# Altium schematic sheet smartBattery.SchDoc
size A4; SheetNumber: 1; SheetTotal: 1
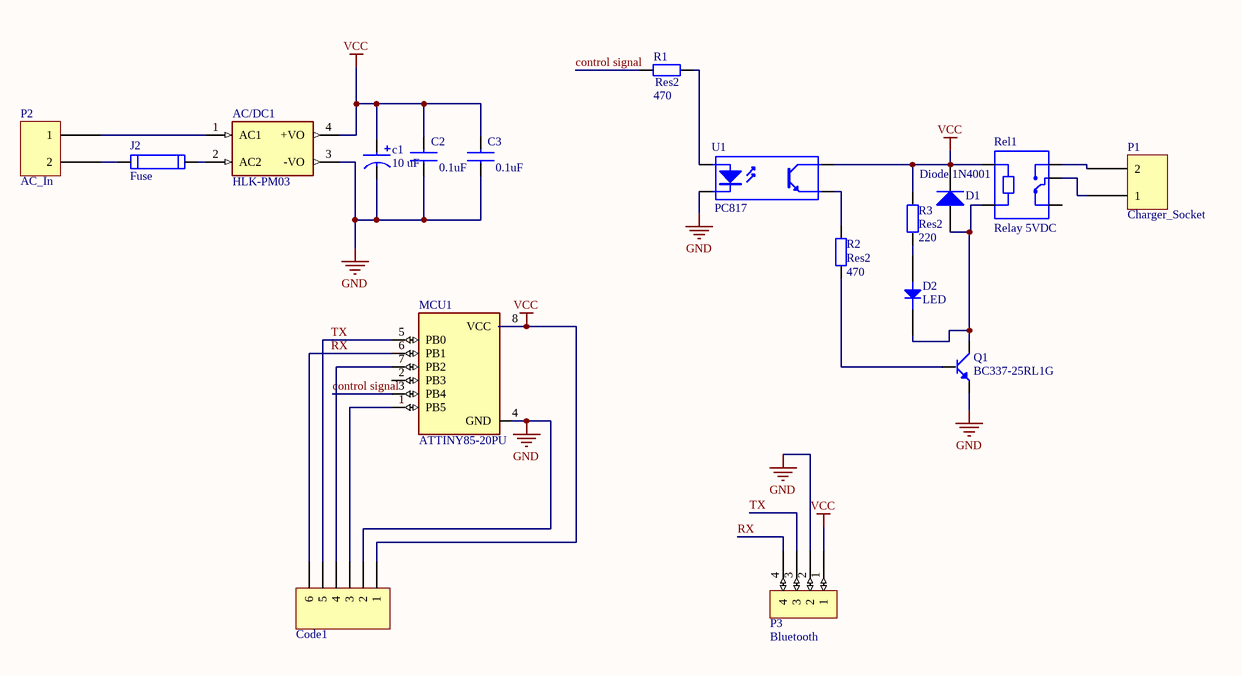
[diagram p0: smartBattery.SchDoc]

## Parts
AC/DC1  HLK-PM03  [CONV_HLK-PM03]
c1  10 uF  [AluminumCap]
C2  0.1uF  [ceramicCapTHT]
C3  0.1uF  [ceramicCapTHT]
Code1  (no value)  [HDR1X6]
D1  Diode 1N4001  [DO-41]
D2  LED  [SDO27]
J2  Fuse  [696310001002]
MCU1  ATTINY85-20PU  [DIP762W46P254L927H533Q8B]
P1  Charger_Socket  [TB_2Pin]
P2  AC_In  [TB_2Pin]
P3  Bluetooth  [pinhead_01x04]
Q1  BC337-25RL1G  [TO-92]
R1  Res2  value 470  [AXIAL-0.4]
R2  Res2  value 470  [AXIAL-0.4]
R3  Res2  value 220  [AXIAL-0.4]
Rel1  Relay 5VDC  [RELAY_SRD-05VDC-SL-C]
U1  PC817  [DIP-4]

## Nets
GND: AC/DC1.3(-VO) c1.2 C2.1 C3.1 Code1.2 MCU1.4(GND) P3.2 Q1.3(E) U1.2(K)
VCC: AC/DC1.4(+VO) c1.1 C2.2 C3.2 Code1.1 D1.2(K) MCU1.8(VCC) P3.1 R3.2 Rel1.A1 U1.4(C)
control signal: MCU1.3(PB4) R1.1
RX: Code1.6 MCU1.6(PB1) P3.4
TX: Code1.5 MCU1.5(PB0) P3.3
NetAC/DC1_1: AC/DC1.1(AC1) P2.1
NetAC/DC1_2: AC/DC1.2(AC2) J2.2
NetCode1_3: Code1.3 MCU1.1(PB5)
NetCode1_4: Code1.4 MCU1.7(PB2)
NetD1_1: D1.1(A) D2.2 Q1.1(C) Rel1.A2
NetD2_1: D2.1 R3.1
NetJ2_1: J2.1 P2.2
NetP1_1: P1.1 Rel1.COM
NetP1_2: P1.2 Rel1.NO
NetQ1_2: Q1.2(B) R2.1
NetR1_2: R1.2 U1.1(A)
NetR2_2: R2.2 U1.3(E)

Not connected (* = marked no-connect by the designer): MCU1 2(PB3); Rel1 NC

## Library data of the parts
AC/DC1 = HLK-PM03: AC DC 3W power module; MF: Hi-link; Package: Package; Availability: Unavailable; SnapEDA_Link: https://www.snapeda.com/parts/HLK-PM03/Hi-link/view-part/3215695/?ref=snap; MP: HLK-PM03; Price: None; Value: *
c1 = AluminumCap: Cap Aluminum 10uF 400V 20% (10 X 16mm) Radial 5mm 150mA 8000 hr 105C Bulk; Manufacturer 1: Nichicon; Manufacturer Part Number 1: UCY2G100MPD; Supplier 1: Digi-Key; Description 1: Cap Aluminum 10uF 400V 20% (10 X 16mm) Radial 5mm 150mA 8000 hr 105C Bulk; Stock 1: 39516; Pricing 1: 1=0.82, 10=0.622, 50=0.5164, 100=0.4447, 500=0.3443, 1000=0.2965, 2500=0.2773, 5000=0.263 (USD); Capacitance: 10 uF; Case Size/Dimension: 10 x 16 mm; Type: Radial; Rated Voltage: 400 V; Operating Temp-Max: 105 C; ComponentLink1URL: http://www.nichicon.co.jp/english/products/pdfs/e-cy.pdf?src-supplier=Avnet; ComponentLink1Description: http://www.nichicon.co.jp/english/products/pdfs/e-cy.pdf?src-supplier=Avnet; ComponentLink2URL: https://www.verical.com/server-webapp/html/getDatasheet?partID=464569&src-supplier=Verical; ComponentLink2Description: https://www.verical.com/server-webapp/html/getDatasheet?partID=464569&src-supplier=Verical; ComponentLink3URL: http://www.farnell.com/datasheets/51405.pdf?src-supplier=Element14; ComponentLink3Description: http://www.farnell.com/datasheets/51405.pdf?src-supplier=Element14; ComponentLink4URL: http://www.farnell.com/datasheets/1914577.pdf?src-supplier=Element14; ComponentLink4Description: http://www.farnell.com/datasheets/1914577.pdf?src-supplier=Element14; ComponentLink5URL: http://www.nichicon.co.jp/english/products/pdfs/e-cy.pdf?src-supplier=Avnet+Europe; ComponentLink5Description: http://www.nichicon.co.jp/english/products/pdfs/e-cy.pdf?src-supplier=Avnet+Europe; Supplier Part Number 1: 493-13387-ND
C2 C3 = ceramicCapTHT: 22pF 50 V dc Ceramic Single Layer Capacitor; Y5R Dielectric THT F Series; Manufacturer 1: Vishay; Manufacturer Part Number 1: F222K69Y5RP63K7R; Description 1: 2.2nF 2000 V dc Ceramic Single Layer Capacitor; Y5R Dielectric THT F Series; Capacitance Tolerance: ± 10%; Capacitor Terminals: Radial Leaded; SVHC: No SVHC (17-Dec-2014); Voltage Rating: 2kV; Supplier 1: Digi-Key; Stock 1: 7107; Pricing 1: 1=0.85, 10=0.624, 50=0.499, 100=0.4277, 500=0.3386, 1000=0.2851, 2500=0.2673, 5000=0.2495 (USD); Capacitance: 0.1uF; Dielectric Characteristic: Y5R; Lead Spacing: 7.5mm; Operating Temperature Max: 125°C; Operating Temperature Min: -30°C; Packaging: Each; Product Range: F Series; ComponentLink1URL: http://www.vishay.com/docs/28536/geninfo-cd-rfi-safcaps.pdf?src-supplier=Digi-Key; ComponentLink1Description: http://www.vishay.com/docs/28536/geninfo-cd-rfi-safcaps.pdf?src-supplier=Digi-Key; ComponentLink2URL: http://www.vishay.com/docs/28500/hvldf02.pdf?src-supplier=Future+Electronics; ComponentLink2Description: http://www.vishay.com/docs/28500/hvldf02.pdf?src-supplier=Future+Electronics; ComponentLink3URL: http://uk.rs-online.com/webdocs/0d81/0900766b80d81bfa.pdf?src-supplier=RSComponents; ComponentLink3Description: http://uk.rs-online.com/webdocs/0d81/0900766b80d81bfa.pdf?src-supplier=RSComponents; ComponentLink4URL: http://datasheet.octopart.com/F222K69Y5RP63K7R-Vishay-datasheet-13535054.pdf?src-supplier=Newark; ComponentLink4Description: http://datasheet.octopart.com/F222K69Y5RP63K7R-Vishay-datasheet-13535054.pdf?src-supplier=Newark; ComponentLink5URL: http://datasheet.octopart.com/F222K69Y5RP63K7R-Vishay-datasheet-62318010.pdf?src-supplier=Element14; ComponentLink5Description: http://datasheet.octopart.com/F222K69Y5RP63K7R-Vishay-datasheet-62318010.pdf?src-supplier=Element14; ComponentLink6URL: http://datasheet.octopart.com/F222K69Y5RP63K7R-Vishay-datasheet-68391036.pdf?src-supplier=Newark; ComponentLink6Description: http://datasheet.octopart.com/F222K69Y5RP63K7R-Vishay-datasheet-68391036.pdf?src-supplier=Newark; ComponentLink7URL: http://datasheet.octopart.com/F222K69Y5RP63K7R-Vishay-datasheet-12512896.pdf?src-supplier=Future+Electronics; ComponentLink7Description: http://datasheet.octopart.com/F222K69Y5RP63K7R-Vishay-datasheet-12512896.pdf?src-supplier=Future+Electronics; ComponentLink8URL: http://datasheet.octopart.com/F222K69Y5RP63K7R-Vishay-datasheet-12545544.pdf?src-supplier=Future+Electronics; ComponentLink8Description: http://datasheet.octopart.com/F222K69Y5RP63K7R-Vishay-datasheet-12545544.pdf?src-supplier=Future+Electronics; ComponentLink9URL: http://datasheet.octopart.com/F222K69Y5RP63K7R-Vishay-datasheet-8817196.pdf?src-supplier=Farnell; ComponentLink9Description: http://datasheet.octopart.com/F222K69Y5RP63K7R-Vishay-datasheet-8817196.pdf?src-supplier=Farnell; ComponentLink10URL: http://datasheet.octopart.com/F222K69Y5RP63K7R-Vishay-datasheet-531293.pdf?src-supplier=Farnell; ComponentLink10Description: http://datasheet.octopart.com/F222K69Y5RP63K7R-Vishay-datasheet-531293.pdf?src-supplier=Farnell; ComponentLink11URL: http://datasheet.octopart.com/F222K69Y5RP63K7R-Vishay-Dale-datasheet-62311638.pdf?src-supplier=Allied+Electronics; ComponentLink11Description: http://datasheet.octopart.com/F222K69Y5RP63K7R-Vishay-Dale-datasheet-62311638.pdf?src-supplier=Allied+Electronics; Supplier Part Number 1: 1241PH-ND
Code1 = Header 6: Header, 6-Pin; LatestRevisionDate: 17-Jul-2002; LatestRevisionNote: Re-released for DXP Platform.; Publisher: Altium Limited
D1 = Diode 1N4001: 1 Amp General Purpose Rectifier; Published: 8-Jun-2000; LatestRevisionDate: 17-Jul-2002; LatestRevisionNote: Re-released for DXP Platform.; DatasheetVersion: 1998; PackageVersion: Aug-1999; PackageReference: DO-41; Publisher: Altium Limited; PackageDescription: Diode, Axial; Body 5.2 x 2.7 mm (LxDia. max), Lead Dia. 0.86 mm (max); Code_JEDEC: DO-204-AL; ComponentLink1Description: Manufacturer Link; ComponentLink1URL: http://www.fairchildsemi.com/; ComponentLink2Description: Datasheet; ComponentLink2URL: http://www.fairchildsemi.com/ds/1N%2F1N4001.pdf
D2 = 1N4148: NTE ELECTRONICS - 1N4148 - Small Signal Diode, Switching, Single, 75 V, 300 mA, 1 V, 4 ns, 1 A; Repetitive Reverse Voltage Vrrm Max: 75V; Forward Current If(AV): 300mA; Forward Voltage VF Max: 1V; Reverse Recovery Time trr Max: 4ns; Forward Surge Current Ifsm Max: 1A; Diode Case Style: DO-204AH; No. of Pins: 2Pins; Product Range: 1N4148 Series; Supplier 1: Digi-Key; Manufacturer 1: NTE Electronics; Manufacturer Part Number 1: 1N4148; Description 1: NTE ELECTRONICS - 1N4148 - Small Signal Diode, Switching, Single, 75 V, 300 mA, 1 V, 4 ns, 1 A; Stock 1: 0; Pricing 1: 25=0.05 (USD); Diode Configuration: Single; Operating Temperature Max: 175°C; Packaging: Each; Automotive Qualification Standard: -; ComponentLink1URL: http://www.farnell.com/datasheets/158116.pdf?src-supplier=Element14; ComponentLink1Description: http://www.farnell.com/datasheets/158116.pdf?src-supplier=Element14; Supplier Part Number 1: 2368-1N4148-ND
J2 = 696310001002: Fuse Holder 20A 250V 1 Circuit Cartridge Through Hole; MF: Wurth Electronics; Package: None; SnapEDA_Link: https://www.snapeda.com/parts/696310001002/Wurth%20Electronics%20Inc./view-part/1196556/?ref=snap; Availability: Warning; MP: 696310001002; Price: None; Purchase-URL: https://pricing.snapeda.com/search/part/696310001002/?ref=eda; Check_prices: https://www.snapeda.com/parts/696310001002/Wurth%20Electronics%20Inc./view-part/1196556/?ref=eda; Value: *
MCU1 = ATTINY85-20PU: AVR AVRÂ® ATtiny, Functional Safety (FuSa) Microcontroller IC 8-Bit 20MHz 8KB (4K x 16) FLASH 8-PDIP; MF: Microchip; MP: ATTINY85-20PU; Price: None; Purchase-URL: https://pricing.snapeda.com/search/part/ATTINY85-20PU/?ref=eda; Package: DIP-8 Atmel; Check_prices: https://www.snapeda.com/parts/ATTINY85-20PU/Microchip/view-part/42827/?ref=eda; Value: *; Availability: Good; SnapEDA_Link: https://www.snapeda.com/parts/ATTINY85-20PU/Microchip/view-part/42827/?ref=snap
P1 P2 = OSTVN02A150: TERM BLK 2P SIDE ENT 2.54MM PCB; Manufacturer 1: On-Shore-Technology-Inc.; Number of Levels: 1; Positions Per Level: 2; Pitch: 0.100" (2.54mm); Mating Orientation: Horizontal with Board; Current: 6A; Voltage: 125V; Wire Gauge: 20-30 AWG; Wire Termination: Screw - Rising Cage Clamp; Clamp Material - Plating: Brass; Screw Material - Plating: Steel - Zinc Plated; Torque - Screw: 0.15 Nm (1.3 Lb-In); Screw Thread: M1.6; Supplier 1: Digi-Key; Manufacturer Part Number 1: OSTVN02A150; Description 1: TERM BLK 2P SIDE ENT 2.54MM PCB; Stock 1: 4786; Pricing 1: 1=0.91, 10=0.568, 25=0.486, 50=0.4368, 100=0.4277, 250=0.364, 500=0.3458, 1000=0.3094, 5000=0.2421 (USD); Category: Connectors, Interconnects; Family: Terminal Blocks - Wire to Board; Series: OSTVN; Packaging: Bulk; Mounting Type: Through Hole; Features: -; Color: Green; Operating Temperature: -30°C ~ 105°C; Housing Material: Thermoplastic; Contact Material - Plating: Brass; ComponentLink1URL: http://www.on-shore.com/wp-content/uploads/2015/09/ostvnxxa150.pdf?src-supplier=Digi-Key; ComponentLink1Description: http://www.on-shore.com/wp-content/uploads/2015/09/ostvnxxa150.pdf?src-supplier=Digi-Key; Supplier Part Number 1: ED10561-ND
P3 = pinheadF_01x04: pin header 01x04 straight
Q1 = BC337-25RL1G: Trans Gp Bjt NPN 45V 0.8A 625MW 3-PIN TO-92 T/r; Manufacturer 1: ON Semiconductor; Configuration: Single; Collector- Base Voltage VCBO: 50 V; Emitter- Base Voltage VEBO: 5 V; Collector-Emitter Saturation Voltage: 0.7 V; Gain Bandwidth Product fT: 210 MHz; DC Collector/Base Gain hfe Min: 160; Supplier 1: Digi-Key; Manufacturer Part Number 1: BC337-25RL1G; Description 1: Trans Gp Bjt NPN 45V 0.8A 625MW 3-PIN TO-92 T/r; Stock 1: 0; Product Category: Bipolar Transistors - BJT; RoHS: Details; Brand: ON Semiconductor; Transistor Polarity: NPN; Collector- Emitter Voltage VCEO Max: 45 V; Maximum DC Collector Current: 0.8 A; Maximum Operating Temperature: + 150 C; Mounting Style: Through Hole; Package / Case: TO-92-3 (TO-226); Maximum Power Dissipation: 625 mW; Minimum Operating Temperature: - 55 C; Packaging: Reel; Series: BC337-25; Factory Pack Quantity: 2000; <PCN>: http://www.mouser.com/PCN/ON_Semiconductor_20685.pdf; ComponentLink1URL: http://www.onsemi.com/pub/Collateral/BC337-D.PDF?src-supplier=Digi-Key; ComponentLink1Description: http://www.onsemi.com/pub/Collateral/BC337-D.PDF?src-supplier=Digi-Key; ComponentLink2URL: http://www.onsemi.com/pub_link/Collateral/BC337-D.PDF?src-supplier=Avnet; ComponentLink2Description: http://www.onsemi.com/pub_link/Collateral/BC337-D.PDF?src-supplier=Avnet; ComponentLink3URL: https://www.verical.com/server-webapp/html/getDatasheet?partID=53827&src-supplier=Verical; ComponentLink3Description: https://www.verical.com/server-webapp/html/getDatasheet?partID=53827&src-supplier=Verical; ComponentLink4URL: http://www.farnell.com/datasheets/1789499.pdf?src-supplier=Element14; ComponentLink4Description: http://www.farnell.com/datasheets/1789499.pdf?src-supplier=Element14; Supplier Part Number 1: BC337-25RL1GOSDKR-ND
R1-R3 = Res2: Resistor; Published: 8-Jun-2000; LatestRevisionDate: 17-Jul-2002; LatestRevisionNote: Re-released for DXP Platform.; PackageReference: AXIAL-0.4; Publisher: Altium Limited; PackageDescription: Axial Device, Thru-Hole; 2 Leads; 0.4 in Pin Spacing
Rel1 = SRD-05VDC-SL-C: 5V Trigger Relay Module For Arduino And Raspberry Pi 5V Trigger Relay Module For Arduino And Raspberry Pi; MF: Songle Relay; Package: None; Availability: Unavailable; Value: *; MP: SRD-05VDC-SL-C; SnapEDA_Link: https://www.snapeda.com/parts/SRD-05VDC-SL-C/Songle%20Relay/view-part/1029484/?ref=snap; Price: None
U1 = Optoisolator1: 4-Pin Phototransistor Optocoupler; Published: 24-Mar-1999; LatestRevisionDate: 04-Mar-2005; LatestRevisionNote: Sch pins 3 & 4 Swapped.; DatasheetVersion: Nov-2003; PackageReference: DIP-4; Publisher: Altium Limited